# EAGLE schematic Sumoboard (EAGLE 9.4.2)
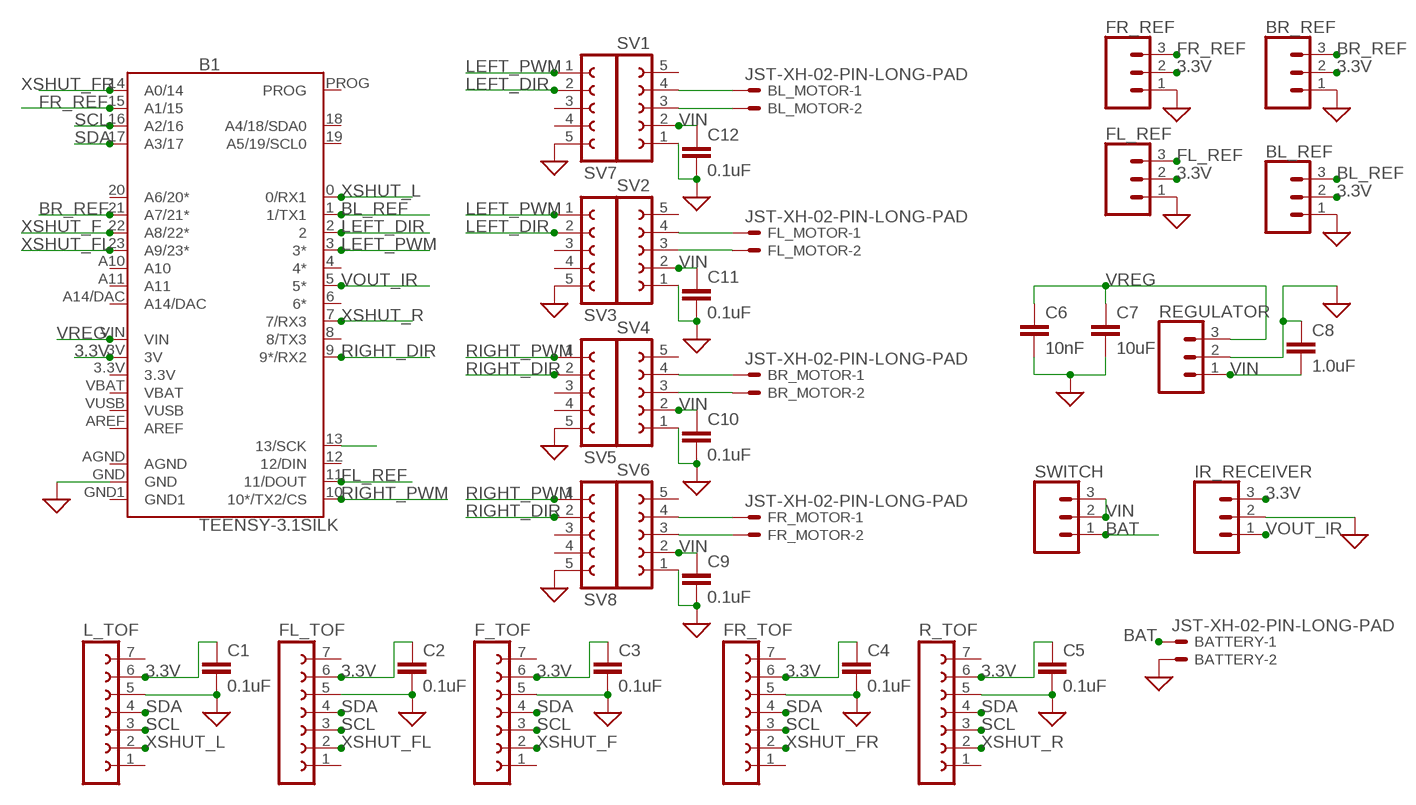
[diagram p0: schematic, sheet 1]

## Parts
B1  TEENSY-3.1SILK  [TEENSY-3.1]
BATTERY  JST-XH-02-PIN-LONG-PAD  [JST-XH-02-PACKAGE-LONG-PAD]
BL_MOTOR  JST-XH-02-PIN-LONG-PAD  [JST-XH-02-PACKAGE-LONG-PAD]
BL_REF  CONN_03  [1X03]
BR_MOTOR  JST-XH-02-PIN-LONG-PAD  [JST-XH-02-PACKAGE-LONG-PAD]
BR_REF  CONN_03  [1X03]
C1  0.1uF  0.1UF-0603-25V-5%  [0603]
C2  0.1uF  0.1UF-0603-25V-5%  [0603]
C3  0.1uF  0.1UF-0603-25V-5%  [0603]
C4  0.1uF  0.1UF-0603-25V-5%  [0603]
C5  0.1uF  0.1UF-0603-25V-5%  [0603]
C6  10nF  10NF-0603-50V-10%  [0603]
C7  10uF  10UF-0603-6.3V-20%  [0603]
C8  1.0uF  1.0UF-0603-16V-10%  [0603]
C9  0.1uF  0.1UF-0603-25V-5%  [0603]
C10  0.1uF  0.1UF-0603-25V-5%  [0603]
C11  0.1uF  0.1UF-0603-25V-5%  [0603]
C12  0.1uF  0.1UF-0603-25V-5%  [0603]
F_TOF  FE07-1  [FE07]
FL_MOTOR  JST-XH-02-PIN-LONG-PAD  [JST-XH-02-PACKAGE-LONG-PAD]
FL_REF  CONN_03  [1X03]
FL_TOF  FE07-1  [FE07]
FR_MOTOR  JST-XH-02-PIN-LONG-PAD  [JST-XH-02-PACKAGE-LONG-PAD]
FR_REF  CONN_03  [1X03]
FR_TOF  FE07-1  [FE07]
IR_RECEIVER  CONN_03  [1X03]
L_TOF  FE07-1  [FE07]
R_TOF  FE07-1  [FE07]
REGULATOR  CONN_03  [1X03]
SV1  FE05-1  [FE05-1]
SV2  FE05-1  [FE05-1]
SV3  FE05-1  [FE05-1]
SV4  FE05-1  [FE05-1]
SV5  FE05-1  [FE05-1]
SV6  FE05-1  [FE05-1]
SV7  FE05-1  [FE05-1]
SV8  FE05-1  [FE05-1]
SWITCH  CONN_03  [1X03]

## Nets
3.3V: B1.3V BL_REF.2 BR_REF.2 C1.1 C2.1 C3.1 C4.1 C5.1 F_TOF.6 FL_REF.2 FL_TOF.6 FR_REF.2 FR_TOF.6 IR_RECEIVER.3 L_TOF.6 R_TOF.6
BAT: BATTERY.1 SWITCH.1
BL_REF: B1.1(1/TX1) BL_REF.3
BR_REF: B1.21(A7/21*) BR_REF.3
FL_REF: B1.11(11/DOUT) FL_REF.3
FR_REF: B1.15(A1/15) FR_REF.3
GND: B1.GND BATTERY.2 BL_REF.1 BR_REF.1 C1.2 C2.2 C3.2 C4.2 C5.2 C6.2 C7.2 C8.1 C9.2 C10.2 C11.2 C12.2 F_TOF.5 FL_REF.1 FL_TOF.5 FR_REF.1 FR_TOF.5 IR_RECEIVER.2 L_TOF.5 R_TOF.5 REGULATOR.2 SV1.1 SV2.1 SV3.5 SV4.1 SV5.5 SV6.1 SV7.5 SV8.5 ; supply symbol labelled SUP
LEFT_DIR: B1.2 SV3.2 SV7.2
LEFT_PWM: B1.3(3*) SV3.1 SV7.1
N$1: BL_MOTOR.2 SV1.3
N$2: BL_MOTOR.1 SV1.4
N$3: BR_MOTOR.1 SV4.4
N$4: BR_MOTOR.2 SV4.3
N$5: FL_MOTOR.1 SV2.4
N$6: FL_MOTOR.2 SV2.3
N$7: FR_MOTOR.1 SV6.4
N$8: FR_MOTOR.2 SV6.3
RIGHT: B1.13(13/SCK)
RIGHT_DIR: B1.9(9*/RX2) SV5.2 SV8.2
RIGHT_PWM: B1.10(10*/TX2/CS) SV5.1 SV8.1
SCL: B1.16(A2/16) F_TOF.3 FL_TOF.3 FR_TOF.3 L_TOF.3 R_TOF.3
SDA: B1.17(A3/17) F_TOF.4 FL_TOF.4 FR_TOF.4 L_TOF.4 R_TOF.4
VIN: C8.2 C9.1 C10.1 C11.1 C12.1 REGULATOR.1 SV1.2 SV2.2 SV4.2 SV6.2 SWITCH.2 SWITCH.3
VOUT_IR: B1.5(5*) IR_RECEIVER.1
VREG: B1.VIN C6.1 C7.1 REGULATOR.3
XSHUT_F: B1.22(A8/22*) F_TOF.2
XSHUT_FL: B1.23(A9/23*) FL_TOF.2
XSHUT_FR: B1.14(A0/14) FR_TOF.2
XSHUT_L: B1.0(0/RX1) L_TOF.2
XSHUT_R: B1.7(7/RX3) R_TOF.2
Unconnected: B1.4(4*) B1.6(6*) B1.8(8/TX3) B1.12(12/DIN) B1.18(A4/18/SDA0) B1.19(A5/19/SCL0) B1.20(A6/20*) B1.A10 B1.A11 B1.A14/DAC B1.AREF B1.PROG F_TOF.1 F_TOF.7 FL_TOF.1 FL_TOF.7 FR_TOF.1 FR_TOF.7 L_TOF.1 L_TOF.7 R_TOF.1 R_TOF.7 SV1.5 SV2.5 SV3.3 SV3.4 SV4.5 SV5.3 SV5.4 SV6.5 SV7.3 SV7.4 SV8.3 SV8.4

## Power pins joined to a net without a drawn wire
3.3V: B1.3.3V
AGND: B1.AGND
GND1: B1.GND1
VBAT: B1.VBAT
VUSB: B1.VUSB

## Library data of the parts
B1 = SparkFun-Boards:TEENSY-3.1: Teensy 3+ Footprint Mechanical footprint with connectors for Teensy Development Board with ARM Cortex. SparkFun Products: Teensy 3.2 <https://www.sparkfun.com/products/13736> Teensy LC <https://www.sparkfun.com/products/13305>; SF_ID: DEV-12646
BATTERY BL_MOTOR BR_MOTOR FL_MOTOR FR_MOTOR = Rembrandt Electronics - JST XH Connectors v1-0:JST-XH-02-PIN: JST XH Connector 2 Pin Wire to board connector. Pitch: 2,54 mm, (0.100") Number of pins: 2 Created by Rembrandt Electronics www.rembrandtelectronics.com
BL_REF BR_REF FL_REF FR_REF IR_RECEIVER REGULATOR SWITCH = SparkFun-Connectors:CONN_03: Multi connection point. Often used as Generic Header-pin footprint for 0.1 inch spaced/style header connections On any of the 0.1 inch spaced packages, you can populate with these: Break Away Headers - Straight <https://www.sparkfun.com/products/116> (PRT-00116) Break Away Male Headers - Right Angle <https://www.sparkfun.com/products/553> (PRT-00553) Female Headers <https://www.sparkfun.com/products/115> (PRT-00115) Break Away Headers - Machine Pin <https://www.sparkfun.com/products/117> (PRT-00117) Break Away Female Headers - Swiss Machine Pin <https://www.sparkfun.com/products/743> (PRT-00743) Stackable Header - 3 Pin (Female, 0.1") <https://www.sparkfun.com/products/13875> (PRT-13875) For SCREWTERMINALS and SPRING TERMINALS visit here: Screw Terimnals on SparkFun.com <https://www.sparkfun.com/search/results?term=Screw+Terminals> (5mm/3.5mm/2.54mm spacing) This device is also useful as a general connection point to wire up your design to another part of your project. Our various solder wires solder well into these plated through hole pads. Hook-Up Wire - Assortment (Stranded, 22 AWG) <https://www.sparkfun.com/products/11375> (PRT-11375) Hook-Up Wire - Assortment (Solid Core, 22 AWG) <https://www.sparkfun.com/products/11367> (PRT-11367) View the entire wire category on our website here <https://www.sparkfun.com/categories/141> Special notes: Molex polarized connector foot print use with SKU : PRT-08232 with associated crimp pins and housings.
C1-C5 C9-C12 = SparkFun-Capacitors:0.1UF: 0.1µF ceramic capacitors A capacitor is a passive two-terminal electrical component used to store electrical energy temporarily in an electric field.; PROD_ID: CAP-08604
C6 = SparkFun-Capacitors:10NF: 0.01uF/10nF/10,000pF ceramic capacitors A capacitor is a passive two-terminal electrical component used to store electrical energy temporarily in an electric field. CAP-09321; PROD_ID: CAP-00867
C7 = SparkFun-Capacitors:10UF: 10.0µF ceramic capacitors A capacitor is a passive two-terminal electrical component used to store electrical energy temporarily in an electric field.; PROD_ID: CAP-11015
C8 = SparkFun-Capacitors:1.0UF: 1µF ceramic capacitors A capacitor is a passive two-terminal electrical component used to store electrical energy temporarily in an electric field.; PROD_ID: CAP-00868
F_TOF FL_TOF FR_TOF L_TOF R_TOF = con-lsta:FE07-1: FEMALE HEADER; OC_FARNELL: unknown; OC_NEWARK: unknown
SV1-SV8 = con-lsta:FE05-1: FEMALE HEADER; OC_FARNELL: unknown; OC_NEWARK: unknown